# Altium schematic sheet Clock.SchDoc
size A4; Organization: Altium Limited; Address1: L3, 12a Rodborough Rd; Address2: Frenchs Forest; Address3: NSW; Address4: Australia 2086
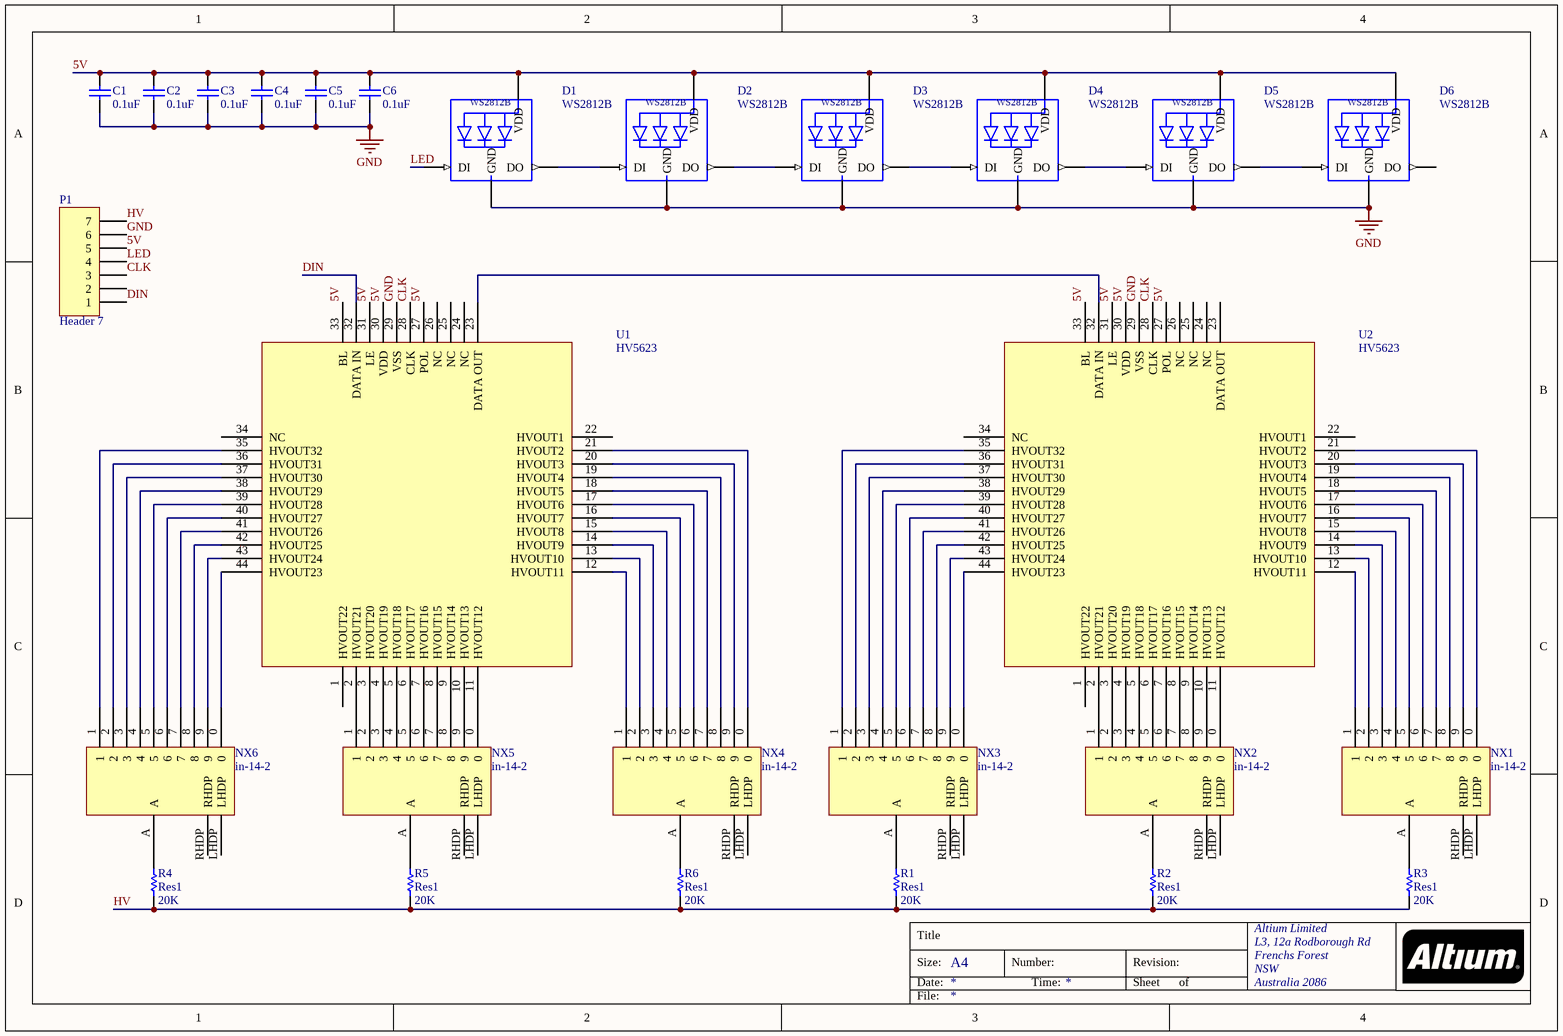
[diagram p0: Clock.SchDoc]

## Parts
C1  0.1uF  [1608[0603]]
C2  0.1uF  [1608[0603]]
C3  0.1uF  [1608[0603]]
C4  0.1uF  [1608[0603]]
C5  0.1uF  [1608[0603]]
C6  0.1uF  [1608[0603]]
D1  WS2812B  [WS2812B]
D2  WS2812B  [WS2812B]
D3  WS2812B  [WS2812B]
D4  WS2812B  [WS2812B]
D5  WS2812B  [WS2812B]
D6  WS2812B  [WS2812B]
NX1  in-14-2  [in-14]
NX2  in-14-2  [in-14]
NX3  in-14-2  [in-14]
NX4  in-14-2  [in-14]
NX5  in-14-2  [in-14]
NX6  in-14-2  [in-14]
P1  Header 7  [HDR1X7]
R1  Res1  value 20K  [1608[0603]]
R2  Res1  value 20K  [1608[0603]]
R3  Res1  value 20K  [1608[0603]]
R4  Res1  value 20K  [1608[0603]]
R5  Res1  value 20K  [1608[0603]]
R6  Res1  value 20K  [1608[0603]]
U1  HV5623  [Quad44]
U2  HV5623  [Quad44]

## Nets
GND: C1.1 C2.1 C3.1 C4.1 C5.1 C6.1 D1.3-GND(GND) D2.3-GND(GND) D3.3-GND(GND) D4.3-GND(GND) D5.3-GND(GND) D6.3-GND(GND) P1.6 U1.29(VSS) U2.29(VSS)
5V: C1.2 C2.2 C3.2 C4.2 C5.2 C6.2 D1.1-VDD(VDD) D2.1-VDD(VDD) D3.1-VDD(VDD) D4.1-VDD(VDD) D5.1-VDD(VDD) D6.1-VDD(VDD) P1.5 U1.27(POL) U1.30(VDD) U1.31(LE) U1.33(BL) U2.27(POL) U2.30(VDD) U2.31(LE) U2.33(BL)
CLK: P1.3 U1.28(CLK) U2.28(CLK)
DIN: P1.1 U1.32(DATA_IN)
HV: P1.7 R1.2 R2.2 R3.2 R4.2 R5.2 R6.2
LED: D1.4-DIN(DI) P1.4
NetD1_2-DOUT: D1.2-DOUT(DO) D2.4-DIN(DI)
NetD2_2-DOUT: D2.2-DOUT(DO) D3.4-DIN(DI)
NetD3_2-DOUT: D3.2-DOUT(DO) D4.4-DIN(DI)
NetD4_2-DOUT: D4.2-DOUT(DO) D5.4-DIN(DI)
NetD5_2-DOUT: D5.2-DOUT(DO) D6.4-DIN(DI)
NetNX1_0: NX1.0 U2.21(HVOUT2)
NetNX1_1: NX1.1 U2.12(HVOUT11)
NetNX1_2: NX1.2 U2.13(HVOUT10)
NetNX1_3: NX1.3 U2.14(HVOUT9)
NetNX1_4: NX1.4 U2.15(HVOUT8)
NetNX1_5: NX1.5 U2.16(HVOUT7)
NetNX1_6: NX1.6 U2.17(HVOUT6)
NetNX1_7: NX1.7 U2.18(HVOUT5)
NetNX1_8: NX1.8 U2.19(HVOUT4)
NetNX1_9: NX1.9 U2.20(HVOUT3)
NetNX1_A: NX1.A R3.1
NetNX2_0: NX2.0 U2.11(HVOUT12)
NetNX2_1: NX2.1 U2.2(HVOUT21)
NetNX2_2: NX2.2 U2.3(HVOUT20)
NetNX2_3: NX2.3 U2.4(HVOUT19)
NetNX2_4: NX2.4 U2.5(HVOUT18)
NetNX2_5: NX2.5 U2.6(HVOUT17)
NetNX2_6: NX2.6 U2.7(HVOUT16)
NetNX2_7: NX2.7 U2.8(HVOUT15)
NetNX2_8: NX2.8 U2.9(HVOUT14)
NetNX2_9: NX2.9 U2.10(HVOUT13)
NetNX2_A: NX2.A R2.1
NetNX3_0: NX3.0 U2.44(HVOUT23)
NetNX3_1: NX3.1 U2.35(HVOUT32)
NetNX3_2: NX3.2 U2.36(HVOUT31)
NetNX3_3: NX3.3 U2.37(HVOUT30)
NetNX3_4: NX3.4 U2.38(HVOUT29)
NetNX3_5: NX3.5 U2.39(HVOUT28)
NetNX3_6: NX3.6 U2.40(HVOUT27)
NetNX3_7: NX3.7 U2.41(HVOUT26)
NetNX3_8: NX3.8 U2.42(HVOUT25)
NetNX3_9: NX3.9 U2.43(HVOUT24)
NetNX3_A: NX3.A R1.1
NetNX4_0: NX4.0 U1.21(HVOUT2)
NetNX4_1: NX4.1 U1.12(HVOUT11)
NetNX4_2: NX4.2 U1.13(HVOUT10)
NetNX4_3: NX4.3 U1.14(HVOUT9)
NetNX4_4: NX4.4 U1.15(HVOUT8)
NetNX4_5: NX4.5 U1.16(HVOUT7)
NetNX4_6: NX4.6 U1.17(HVOUT6)
NetNX4_7: NX4.7 U1.18(HVOUT5)
NetNX4_8: NX4.8 U1.19(HVOUT4)
NetNX4_9: NX4.9 U1.20(HVOUT3)
NetNX4_A: NX4.A R6.1
NetNX5_0: NX5.0 U1.11(HVOUT12)
NetNX5_1: NX5.1 U1.2(HVOUT21)
NetNX5_2: NX5.2 U1.3(HVOUT20)
NetNX5_3: NX5.3 U1.4(HVOUT19)
NetNX5_4: NX5.4 U1.5(HVOUT18)
NetNX5_5: NX5.5 U1.6(HVOUT17)
NetNX5_6: NX5.6 U1.7(HVOUT16)
NetNX5_7: NX5.7 U1.8(HVOUT15)
NetNX5_8: NX5.8 U1.9(HVOUT14)
NetNX5_9: NX5.9 U1.10(HVOUT13)
NetNX5_A: NX5.A R5.1
NetNX6_0: NX6.0 U1.44(HVOUT23)
NetNX6_1: NX6.1 U1.35(HVOUT32)
NetNX6_2: NX6.2 U1.36(HVOUT31)
NetNX6_3: NX6.3 U1.37(HVOUT30)
NetNX6_4: NX6.4 U1.38(HVOUT29)
NetNX6_5: NX6.5 U1.39(HVOUT28)
NetNX6_6: NX6.6 U1.40(HVOUT27)
NetNX6_7: NX6.7 U1.41(HVOUT26)
NetNX6_8: NX6.8 U1.42(HVOUT25)
NetNX6_9: NX6.9 U1.43(HVOUT24)
NetNX6_A: NX6.A R4.1
NetU1_23: U1.23(DATA_OUT) U2.32(DATA_IN)

Not connected (* = marked no-connect by the designer): D6 2-DOUT(DO); NX1 LHDP RHDP; NX2 LHDP RHDP; NX3 LHDP RHDP; NX4 LHDP RHDP; NX5 LHDP RHDP; NX6 LHDP RHDP; P1 2; U1 1(HVOUT22) 22(HVOUT1) 24(NC) 25(NC) 26(NC) 34(NC); U2 1(HVOUT22) 22(HVOUT1) 23(DATA_OUT) 24(NC) 25(NC) 26(NC) 34(NC)

## Notes on the sheet
- Title
- Size:
- Date:
- A4
- Number:
- Time:
- Revision:
- Sheet
- of
- File:

## Library data of the parts
C1-C6 = Cap: Capacitor; Published: 8-Jun-2000; LatestRevisionDate: 17-Jul-2002; LatestRevisionNote: Re-released for DXP Platform.; PackageReference: RAD-0.3; Publisher: Altium Limited; PackageDescription: Radial Cap, Thru-Hole; 2 Leads; 0.3 in Pin Spacing
D1-D6 = WS2812B: Raspberry Pi HAT _40 pin_ Wheeled Robotics Kit; MF: SparkFun Electronics; Availability: Unavailable; SnapEDA_Link: https://www.snapeda.com/parts/WS2812B/Worldsemi/view-part/1038297/?ref=snap; MP: WS2812B; Price: None; Value: *; Package: None
NX1-NX6 = in-8
P1 = Header 7: Header, 7-Pin; LatestRevisionDate: 17-Jul-2002; LatestRevisionNote: Re-released for DXP Platform.; Publisher: Altium Limited
R1-R6 = Res1: Resistor; Published: 8-Jun-2000; LatestRevisionDate: 17-Jul-2002; LatestRevisionNote: Re-released for DXP Platform.; PackageReference: AXIAL-0.3; Publisher: Altium Limited; PackageDescription: Axial Device, Thru-Hole; 2 Leads; 0.3 in Pin Spacing
U1 U2 = HV5622